# EAGLE design Servorino_FT230X_brick (EAGLE 9.6.2)
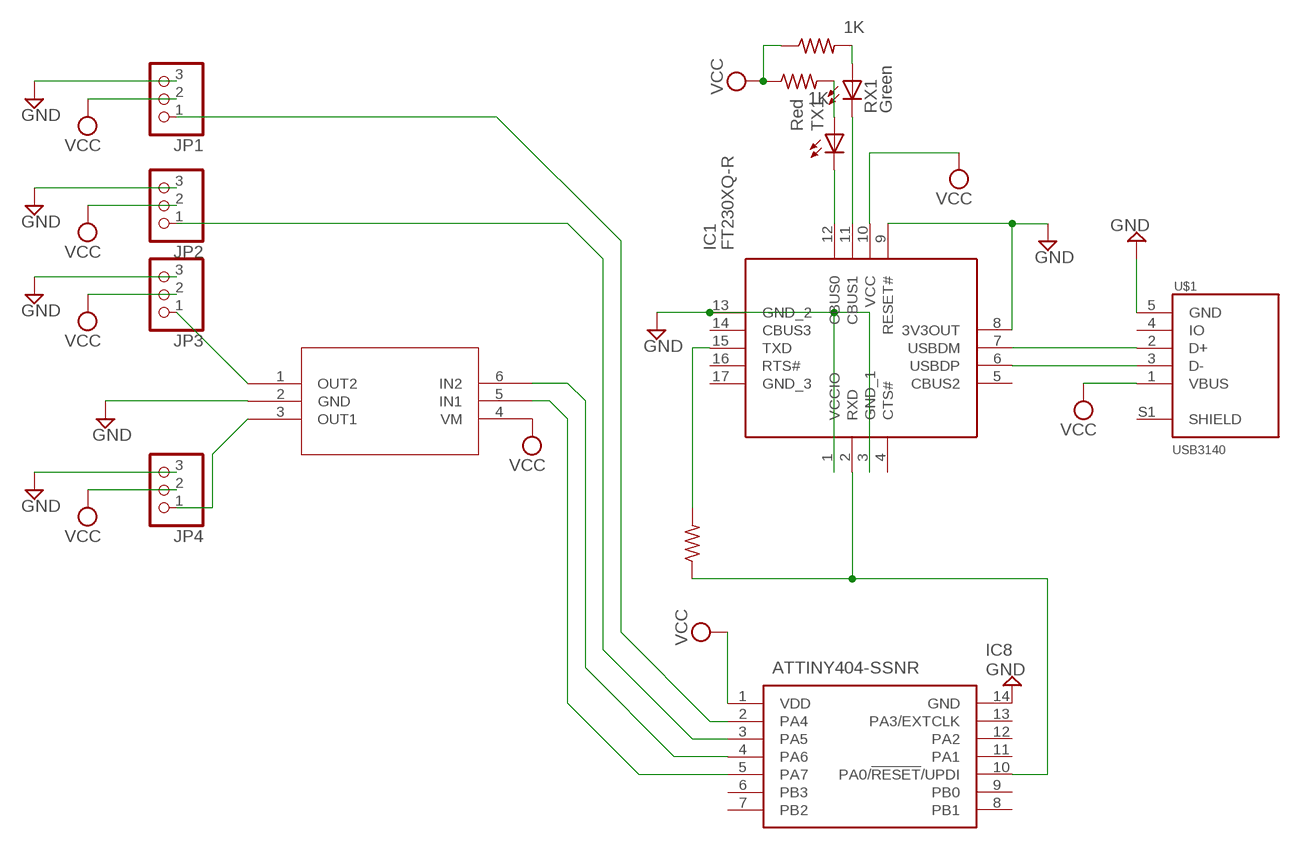
[diagram p0: schematic, sheet 1]

## Parts
IC1  FT230XQ-R  [QFN65P400X400X80-17N]
IC8  ATTINY404-SSNR  [SOIC127P600X175-14N]
JP1  PINHD-1X3  [1X03]
JP2  PINHD-1X3  [1X03]
JP3  PINHD-1X3  [1X03]
JP4  PINHD-1X3  [1X03]
R4  1K  R-US_R0805  [R0805]
R5  1K  R-US_R0805  [R0805]
R6  470  R-US_R0805  [R0805]
RX1  Green  LEDCHIP-LED0805  [CHIP-LED0805]
TX1  Red  LEDCHIP-LED0805  [CHIP-LED0805]
U2  TPM16050-S6TRSOT23-6_TPK-L  [SOT23-6_TPK-L]
U$1  USB3140  [USB3140-30-0170-0-C]

## Nets
GND: IC1.1(VCCIO) IC1.3(GND_1) IC1.8(3V3OUT) IC1.9(RESET#) IC1.13(GND_2) IC8.14(GND) JP1.3 JP2.3 JP3.3 JP4.3 U2.2(GND) U$1.5(GND)
N$1: IC8.2(PA4) JP1.1
N$2: IC8.4(PA6) U2.6(IN2)
N$3: JP3.1 U2.1(OUT2)
N$4: IC8.3(PA5) JP2.1
N$6: IC8.5(PA7) U2.5(IN1)
N$7: R4.2 RX1.A
N$8: R5.2 TX1.A
N$9: IC1.11(CBUS1) RX1.C
N$10: IC1.12(CBUS0) TX1.C
N$11: IC1.15(TXD) R6.2
N$12: IC1.6(USBDP) U$1.3(D-)
N$13: IC1.2(RXD) IC8.10(PA0/!RESET!/UPDI) R6.1
N$14: IC1.7(USBDM) U$1.2(D+)
N$16: JP4.1 U2.3(OUT1)
VCC: IC1.10(VCC) IC8.1(VDD) JP1.2 JP2.2 JP3.2 JP4.2 R4.1 R5.1 U2.4(VM) U$1.1(VBUS)
Unconnected: IC1.4(CTS#) IC1.5(CBUS2) IC1.14(CBUS3) IC1.16(RTS#) IC1.17(GND_3) IC8.6(PB3) IC8.7(PB2) IC8.8(PB1) IC8.9(PB0) IC8.11(PA1) IC8.12(PA2) IC8.13(PA3/EXTCLK) U$1.4(IO) U$1.S1(SHIELD)

## Library data of the parts
IC1 = SamacSys_Parts:FT230XQ-R: X-Chip USB to Basic UART Interface FTDI Chip FT230XQ-R UART Interface 3MBd, 5 V, 16-Pin, QFN Source: Datasheet <https://componentsearchengine.com/Datasheets/1/FT230XQ-R.pdf>; DESCRIPTION: X-Chip USB to Basic UART Interface FTDI Chip FT230XQ-R UART Interface 3MBd, 5 V, 16-Pin, QFN; HEIGHT: 0.8mm; MANUFACTURER_NAME: FTDI Chip; MANUFACTURER_PART_NUMBER: FT230XQ-R; MOUSER_PART_NUMBER: 895-FT230XQ-R; MOUSER_PRICE-STOCK: https://www.mouser.co.uk/ProductDetail/FTDI/FT230XQ-R?qs=Gp1Yz1mis3VvmXwyDmIHOg%3D%3D
IC8 = SamacSys_Parts:ATTINY404-SSNR: MICROCHIP - ATTINY404-SSNR - MCU, 8BIT, 20MHZ, SOIC-14 Source: Datasheet <https://datasheet.datasheetarchive.com/originals/distributors/DKDS-39/8204.pdf>; DESCRIPTION: MICROCHIP - ATTINY404-SSNR - MCU, 8BIT, 20MHZ, SOIC-14; HEIGHT: 1.75mm; MANUFACTURER_NAME: Microchip; MANUFACTURER_PART_NUMBER: ATTINY404-SSNR; MOUSER_PART_NUMBER: 556-ATTINY404-SSNR; MOUSER_PRICE-STOCK: https://www.mouser.co.uk/ProductDetail/Microchip-Technology-Atmel/ATTINY404-SSNR?qs=F5EMLAvA7IAEqD7Aw0z%252B9Q%3D%3D
JP1-JP4 = pinhead:PINHD-1X3: PIN HEADER
R4-R6 = adafruit:R-US_: RESISTOR, American symbol
RX1 TX1 = adafruit:LED: LED OSRAM: - CHIPLED LG R971, LG N971, LY N971, LG Q971, LY Q971, LO R971, LY R971 LH N974, LH R974 LS Q976, LO Q976, LY Q976 LO Q996 - Hyper CHIPLED LW Q18S LB Q993, LB Q99A, LB R99A - SideLED LS A670, LO A670, LY A670, LG A670, LP A670 LB A673, LV A673, LT A673, LW A673 LH A674 LY A675 LS A676, LA A676, LO A676, LY A676, LW A676 LS A679, LY A679, LG A679 - Hyper Micro SIDELED® LS Y876, LA Y876, LO Y876, LY Y876 LT Y87S - SmartLED LW L88C, LW L88S LB L89C, LB L89S, LG L890 LS L89K, LO L89K, LY L89K LS L896, LA L896, LO L896, LY L896 - TOPLED LS T670, LO T670, LY T670, LG T670, LP T670 LSG T670, LSP T670, LSY T670, LOP T670, LYG T670 LG T671, LOG T671, LSG T671 LB T673, LV T673, LT T673, LW T673 LH T674 LS T676, LA T676, LO T676, LY T676, LB T676, LH T676, LSB T676, LW T676 LB T67C, LV T67C, LT T67C, LS T67K, LO T67K, LY T67K, LW E67C LS E67B, LA E67B, LO E67B, LY E67B, LB E67C, LV E67C, LT E67C LW T67C LS T679, LY T679, LG T679 LS T770, LO T770, LY T770, LG T770, LP T770 LB T773, LV T773, LT T773, LW T773 LH T774 LS E675, LA E675, LY E675, LS T675 LS T776, LA T776, LO T776, LY T776, LB T776 LHGB T686 LT T68C, LB T68C - Hyper Mini TOPLED® LB M676 - Mini TOPLED Santana® LG M470 LS M47K, LO M47K, LY M47K Source: http://www.osram.convergy.de/
U2 = brockology:TPM16050-S6TR; COPYRIGHT: Copyright (C) 2025 Ultra Librarian. All rights reserved.; MANUFACTURER_PART_NUMBER: TPM16050-S6TR; MFR_NAME: 3Peak
U$1 = USB:USB3140

## Board
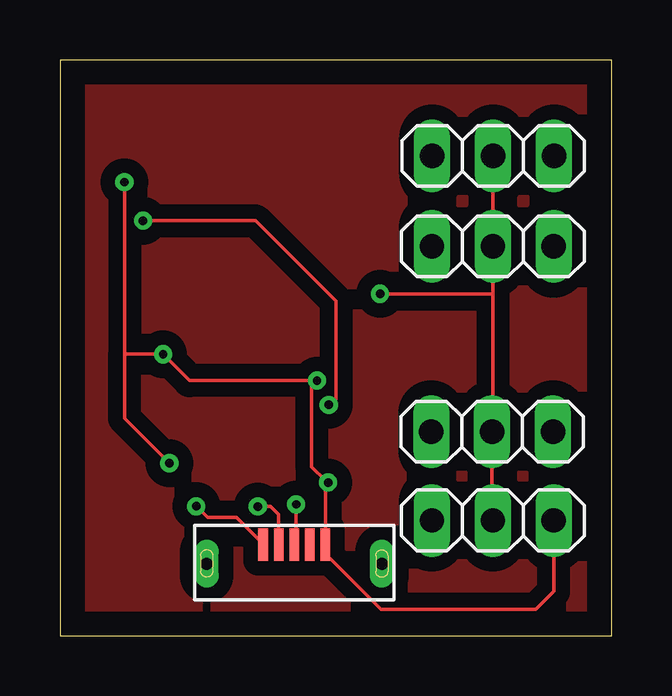
[diagram p1: board, top side]
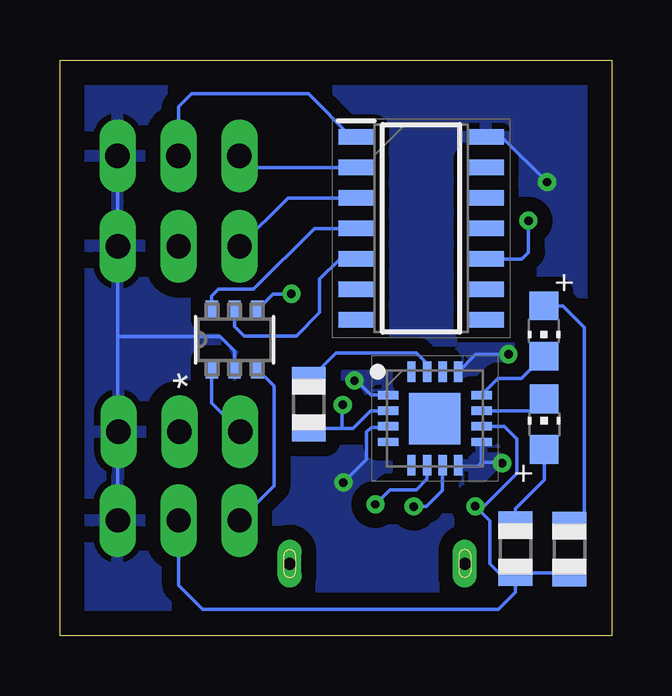
[diagram p2: board, bottom side, seen from below]

Size 23 x 24 mm. Coordinates in mm from the lower left corner, seen from the top.
Outline: 0,0 23,0 23,24 0,24 0,0
Copper layers (1*16): Top 0.035mm / dielectric 1.5mm / Bottom 0.035mm
Design rules "default": minimum track width 6mil, minimum drill 0.35mm, track to track 6mil, track to pad 6mil, pad to pad 6mil, via to via 6mil, smd to smd 6mil, copper to edge 40mil, drill to drill 6mil, minimum pad ring 10mil, minimum via ring 8mil, stop-mask expansion 4mil, vias tented up to drill 0mil, thermal gap 10mil

### Footprints (pad centres in the part's own frame; a part is rotated, then mirrored left to right if it is on the bottom)
QFN65P400X400X80-17N = smd 0.85 x 0.35: 1 -1.95,0.975; 2 -1.95,0.325; 3 -1.95,-0.325; 4 -1.95,-0.975; 9 1.95,-0.975; 10 1.95,-0.325; 11 1.95,0.325; 12 1.95,0.975 | smd 0.35 x 0.85: 5 -0.975,-1.95; 6 -0.325,-1.95; 7 0.325,-1.95; 8 0.975,-1.95; 13 0.975,1.95; 14 0.325,1.95; 15 -0.325,1.95; 16 -0.975,1.95 | smd 2.15 x 2.15: 17 0,0
SOIC127P600X175-14N = smd 1.5 x 0.65: 1 -2.7,3.81; 2 -2.7,2.54; 3 -2.7,1.27; 4 -2.7,0; 5 -2.7,-1.27; 6 -2.7,-2.54; 7 -2.7,-3.81; 8 2.7,-3.81; 9 2.7,-2.54; 10 2.7,-1.27; 11 2.7,0; 12 2.7,1.27; 13 2.7,2.54; 14 2.7,3.81
1X03 = drill 1.016 long: 1 -2.54,0; 2 0,0; 3 2.54,0
R0805 = smd 1.1 x 1.4: 1 -1,0; 2 1,0
CHIP-LED0805 = smd 1.2 x 1.2: A 0,-1.05; C 0,1.05
SOT23-6_TPK-L = smd 0.775 x 0.508: 1 -1.238,0.95; 2 -1.238,0; 3 -1.238,-0.95; 4 1.238,-0.95; 5 1.238,0; 6 1.238,0.95
USB3140-30-0170-0-C = smd 0.4 x 1.35: 1 -1.3,0; 2 -0.65,0; 3 0,0; 4 0.65,0; 5 1.3,0 | drill 0.5 pad 0.775 long: S1 3.65,-0.8; S3 -3.65,-0.8

### Placement (x,y rotation side)
IC1  7.37,9.05 0 bottom
IC8  7.94,16.98 0 bottom
JP1  18.06,20 0 top
JP2  18.05,16.23 0 top
JP3  18.02,8.5 0 top
JP4  18.05,4.8 0 top
R4  4.01,3.62 90 bottom
R5  1.76,3.61 90 bottom
R6  12.62,9.64 90 bottom
RX1  2.81,8.81 0 bottom
TX1  2.82,12.7 180 bottom
U2  15.72,12.34 90 bottom
U$1  9.77,3.8 0 top

### Tracks (layer width: path | path; a pad name or v marks a point on that pad's centre or on a via)
GND  (via drill 0.35)
  Top 0.152: 11.07,6.46 U$1.5 11.07,3.4 13.38,1.09 19.84,1.09 20.59,1.84 JP4.3 | v11.18,6.38 v11.19,6.37 11.19,6.36 11.18,6.35 11.07,6.46 | v4.56,7.19 2.69,9.06 2.69,11.69 | 2.69,11.69 2.73,11.73 v4.3,11.73 5.4,10.63 v10.72,10.63 10.49,10.4 10.49,7.04 11.07,6.46 | v2.69,18.91 v2.69,18.9 2.69,11.69
  Bottom 0.152: IC1.3 9.37,8.68 10.02,8.68 10.21,8.49 10.21,7.35 v11.18,6.38 | IC1.9 5.42,7.21 | 5.42,7.21 5.57,7.06 6.36,7.06 IC1.8 | 5.42,7.21 4.64,7.21 4.62,7.19 v4.56,7.19 | IC1.13 5.68,11.71 4.3,11.71 v4.3,11.73 | IC1.1 10.03,10.03 10.65,10.65 10.7,10.65 v10.72,10.63 | IC8.14 4.57,20.79 v2.69,18.91 | JP1.3 JP2.3 20.59,12.46 | 20.59,12.46 20.59,8.53 JP3.3 20.59,8.47 JP4.3 | U2.2 15.72,11.86 16.32,12.46 20.59,12.46
  pour Bottom (isolate 0.61): -1,25 24.5,25 24.5,-1 -1,-1
N$1
  Bottom 0.152: IC8.2 15.04,19.52 JP1.1
N$2
  Bottom 0.152: IC8.4 12.39,16.98 14.93,14.44 16.38,14.44 16.67,14.15 U2.6
N$3
  Bottom 0.152: U2.1 16.67,9.69 JP3.1
N$4
  Bottom 0.152: IC8.3 13.49,18.25 JP2.1
N$6
  Bottom 0.152: U2.5 15.72,12.89 15.32,12.49 14.16,12.49 14.11,12.49 13.14,12.49 12.17,13.46 12.17,14.87 11.33,15.71 IC8.5
N$7
  Bottom 0.152: RX1.A 2.81,6.49 4.01,5.29 R4.2
N$8
  Bottom 0.152: R5.2 1.45,4.61 1.13,4.93 1.13,12.85 2.03,13.75 TX1.A
N$9
  Bottom 0.152: IC1.11 3.29,9.38 RX1.C
N$10
  Bottom 0.152: IC1.12 4.74,10.71 3.76,10.71 TX1.C
N$11
  Bottom 0.152: R6.2 11.48,11.78 8.13,11.78 7.7,11.35 IC1.15
N$12  (via drill 0.35)
  Top 0.152: v9.85,5.47 9.85,3.88 U$1.3
  Bottom 0.152: v9.85,5.47 9.24,6.08 8.14,6.08 7.7,6.53 IC1.6
N$13  (via drill 0.35)
  Top 0.152: v3.46,17.3 8.15,17.3 11.51,13.94 11.51,9.85 11.28,9.62 v11.21,9.62
  Bottom 0.152: IC1.2 10.05,9.38 10.79,8.64 11.24,8.64 | 11.24,8.64 R6.1 | IC8.10 3.73,15.71 3.46,15.97 v3.46,17.3 | v11.21,9.62 11.24,9.59 11.24,8.64
N$14  (via drill 0.35)
  Top 0.152: U$1.2 9.12,5.06 8.79,5.39 8.29,5.39 8.28,5.38 v8.25,5.38
  Bottom 0.152: IC1.7 7.04,6.04 7.71,5.38 v8.25,5.38
N$16
  Bottom 0.152: 15.51,5.02 JP4.1 14.08,6.23 14.08,10.41 U2.3
TOPSIGNAL
  pour Top (isolate 0.61): -0.5,24.5 24,24.5 24,-0.5 -0.5,-0.5
VCC  (via drill 0.35)
  Top 0.152: U$1.1 8.47,3.82 7.37,4.92 6.15,4.92 v5.68,5.39 | JP1.2 JP2.2 18.05,14.22 | 18.05,14.22 18.05,8.53 JP3.2 18.02,4.83 JP4.2 | v13.35,14.25 18.02,14.25 18.05,14.22
  Bottom 0.152: IC1.10 4.47,8.72 3.94,8.19 3.94,6.77 5.33,5.38 5.74,5.38 5.73,5.39 v5.68,5.39 5.07,4.78 5.07,3 4.69,2.62 R4.1 | R4.1 R5.1 | R4.1 4.01,1.8 4.72,1.09 17.05,1.09 18.05,2.09 JP4.2 18.02,4.83 | IC8.1 10.84,20.79 12.64,22.59 17.52,22.59 18.06,22.05 JP1.2 | JP2.2 | 18.05,8.53 JP3.2 | U2.4 14.12,14.23 13.37,14.23 v13.35,14.25